# Altium schematic sheet Power.SchDoc
size A; SheetNumber: 3; SheetTotal: 4
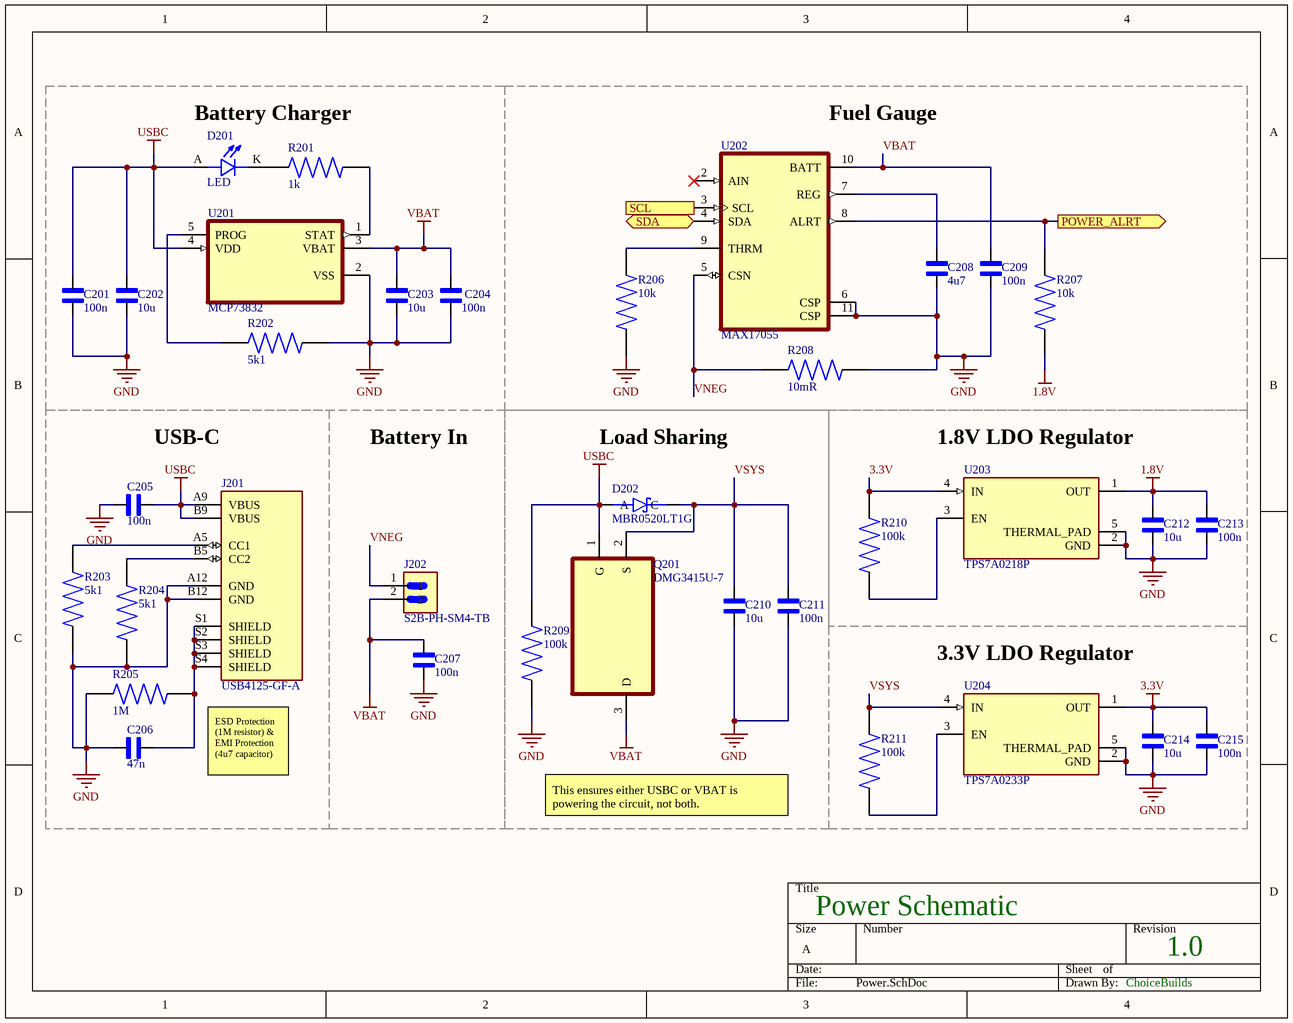
[diagram p0: Power.SchDoc]

## Parts
C201  100n  [0402c]
C202  10u  [0603c]
C203  10u  [0603c]
C204  100n  [0402c]
C205  100n  [0402c]
C206  47n  [0402c]
C207  100n  [0402c]
C208  4u7  [0603c]
C209  100n  [0402c]
C210  10u  [0603c]
C211  100n  [0402c]
C212  10u  [0603c]
C213  100n  [0402c]
C214  10u  [0603c]
C215  100n  [0402c]
D201  LED  [.LED]
D202  MBR0520LT1G  [MBR0520LT1G]
J201  USB4125-GF-A  [USB4125-GF-A]
J202  S2B-PH-SM4-TB  [S2B-PH-SM4-TB]
Q201  DMG3415U-7  [DMG3415U-7]
R201  1k  [0402r]
R202  5k1  [0402r]
R203  5k1  [0402r]
R204  5k1  [0402r]
R205  1M  [0402r]
R206  10k  [0402r]
R207  10k  [0402r]
R208  10mR  [0805r]
R209  100k  [0402r]
R210  100k  [0402r]
R211  100k  [0402r]
U201  MCP73832  [MCP73832]
U202  MAX17055  [MAX17055]
U203  TPS7A0218P  [TPS7A0218P]
U204  TPS7A0233P  [TPS7A0233P]

## Blocks framed on the sheet
Battery Charger: C201-C204 D201 R201 R202 U201
Fuel Gauge: C208 C209 R206-R208 U202
USB-C: C205 C206 J201 R203-R205
Battery In: C207 J202
Load Sharing: C210 C211 D202 Q201 R209
1.8V LDO Regulator: C212 C213 R210 U203
3.3V LDO Regulator: C214 C215 R211 U204

## Ports
POWER_ALRT (out), SCL (in), SDA (bidir)

## Nets
1.8V: C212.2 C213.2 R207.1 U203.1(OUT)
3.3V: C214.2 C215.2 R210.2 U203.4(IN) U204.1(OUT)
GND: C201.1 C202.1 C203.1 C204.1 C205.1 C206.1 C207.2 C208.1 C209.1 C210.1 C211.1 C212.1 C213.1 C214.1 C215.1 J201.A12(GND) J201.B12(GND) R202.2 R203.1 R204.1 R205.1 R206.1 R208.2 R209.1 U201.2(VSS) U202.6(CSP) U202.11(CSP) U203.2(GND) U203.5(THERMAL_PAD) U204.2(GND) U204.5(THERMAL_PAD)
USBC: C201.2 C202.2 C205.2 D201.A D202.A J201.A9(VBUS) J201.B9(VBUS) Q201.1(G) R209.2 U201.4(VDD)
VBAT: C203.2 C204.2 C207.1 C209.2 J202.2 Q201.3(D) U201.3(VBAT) U202.10(BATT)
POWER_ALRT: R207.2 U202.8(ALRT) ; port POWER_ALRT
SCL: U202.3(SCL) ; port SCL
SDA: U202.4(SDA) ; port SDA
VNEG: J202.1 R208.1 U202.5(CSN)
VSYS: C210.2 C211.2 D202.C Q201.2(S) R211.2 U204.4(IN)
NetC206_2: C206.2 J201.S1(SHIELD) J201.S2(SHIELD) J201.S3(SHIELD) J201.S4(SHIELD) R205.2
NetC208_2: C208.2 U202.7(REG)
NetD201_K: D201.K R201.1
NetJ201_A5: J201.A5(CC1) R203.2
NetJ201_B5: J201.B5(CC2) R204.2
NetR201_2: R201.2 U201.1(STAT)
NetR202_1: R202.1 U201.5(PROG)
NetR206_2: R206.2 U202.9(THRM)
NetR210_1: R210.1 U203.3(EN)
NetR211_1: R211.1 U204.3(EN)

Not connected (* = marked no-connect by the designer): U202 2(AIN)*

## Notes on the sheet
- ESD Protection (1M resistor) & EMI Protection (4u7 capacitor)
- This ensures either USBC or VBAT is powering the circuit, not both.
- Power Schematic
- 1.0
- ChoiceBuilds

## Library data of the parts
C201 C204-C207 C209 C211 C213 C215 = 0402c
C202 C203 C208 C210 C212 C214 = 0603c
D201 = .LED
R201-R207 R209-R211 = 0402r
R208 = 0805r